# Altium project DD2090_4CAM_FFC_R0M0E0.PrjPcb (part 1 of 5)
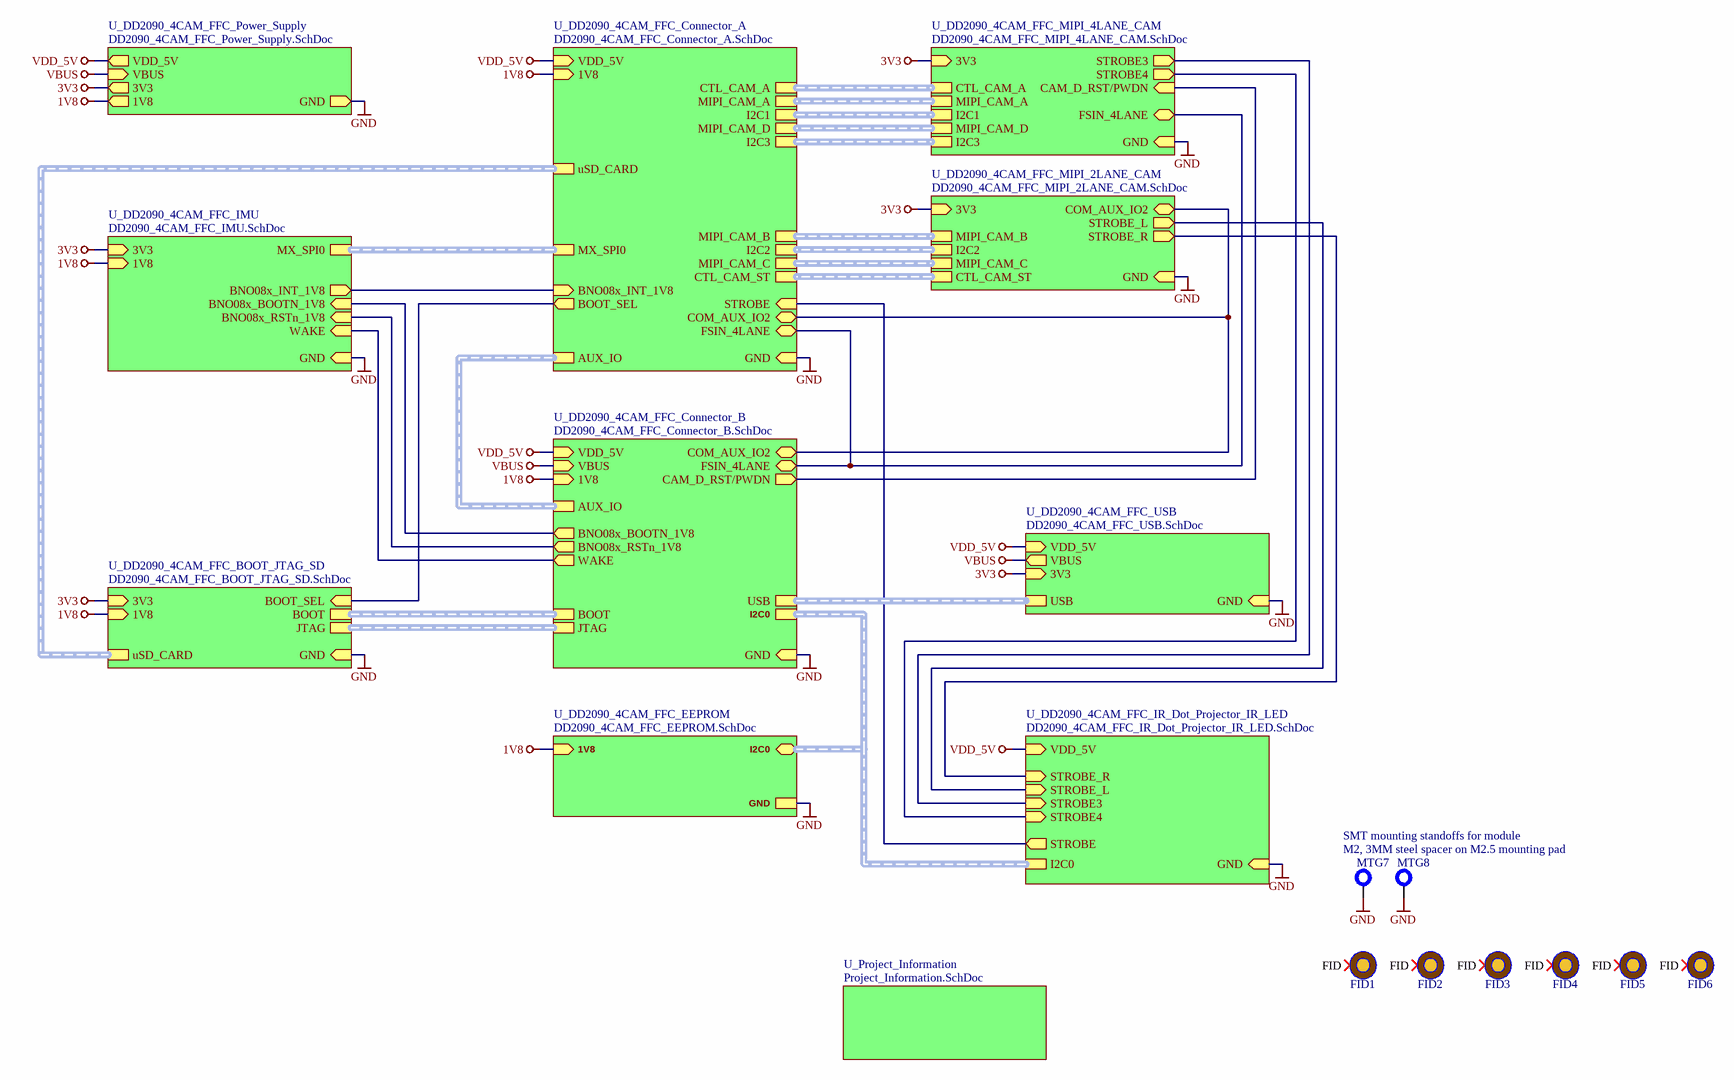
[diagram p0: DD2090_4CAM_FFC_TopLevel.SchDoc]
document_number: D0000190; drawn_by: Dan Dunga; project_title: DD2090 4CAM FFC; rev: R0M0E0
10 sheets, 166 parts. Net scope: strictly hierarchical (ports join the sheet entries above them; power ports are local).
Board file: DD2090_4CAM_FFC.PcbDoc
Sheets:
  DD2090_4CAM_FFC_TopLevel.SchDoc
    U_DD2090_4CAM_FFC_USB = DD2090_4CAM_FFC_USB.SchDoc
    U_Project_Information = Project_Information.SchDoc
    U_DD2090_4CAM_FFC_Power_Supply = DD2090_4CAM_FFC_Power_Supply.SchDoc
    U_DD2090_4CAM_FFC_IMU = DD2090_4CAM_FFC_IMU.SchDoc
    U_DD2090_4CAM_FFC_BOOT_JTAG_SD = DD2090_4CAM_FFC_BOOT_JTAG_SD.SchDoc
    U_DD2090_4CAM_FFC_MIPI_2LANE_CAM = DD2090_4CAM_FFC_MIPI_2LANE_CAM.SchDoc
    U_DD2090_4CAM_FFC_MIPI_4LANE_CAM = DD2090_4CAM_FFC_MIPI_4LANE_CAM.SchDoc
    U_DD2090_4CAM_FFC_Connector_A = DD2090_4CAM_FFC_Connector_A.SchDoc
    U_DD2090_4CAM_FFC_Connector_B = DD2090_4CAM_FFC_Connector_B.SchDoc

## Sheet DD2090_4CAM_FFC_TopLevel.SchDoc: =project_title
size Tabloid; PageSetup: Record=PageOptions|CenterHorizontal=True|CenterVertical=True|PrintScale=0.73|XCorrection=1.00|YCorrection=1.00|PrintKind=0|BorderSize=5000000|LeftOffset=0|BottomOffset=0|Orientation=2|PaperLength=1000|PaperWidth=1000|Scale=100|PaperSource=7|PrintQuality=-4|MediaType=1|DitherType=10|PaperKind=A4|PrintScaleMode=1; CompanyName: Luxonis Holding; DrawnBy: Dan Dunga; Organization: Luxonis Holding; Address1: 1925 Harmony Park Drive; Address2: Westminster, CO; Address3: 80234; Address4: United States; DocumentNumber: D0000190; SheetNumber: 1; SheetTotal: 12

### Parts
FID1  FIDUCIAL_ROUND_1MM  [FIDUCIAL_ROUND_1MM]  (value not drawn)  (no BOM)
FID2  FIDUCIAL_ROUND_1MM  [FIDUCIAL_ROUND_1MM]  (value not drawn)  (no BOM)
FID3  FIDUCIAL_ROUND_1MM  [FIDUCIAL_ROUND_1MM]  (value not drawn)  (no BOM)
FID4  FIDUCIAL_ROUND_1MM  [FIDUCIAL_ROUND_1MM]  (value not drawn)  (no BOM)
FID5  FIDUCIAL_ROUND_1MM  [FIDUCIAL_ROUND_1MM]  (value not drawn)  (no BOM)
FID6  FIDUCIAL_ROUND_1MM  [FIDUCIAL_ROUND_1MM]  (value not drawn)  (no BOM)
MTG7  M2, 3MM steel spacer on M2.5 mounting pad  [9774030243R]
MTG8  M2, 3MM steel spacer on M2.5 mounting pad  [9774030243R]  (value not drawn)

### Sub-sheets
U_DD2090_4CAM_FFC_BOOT_JTAG_SD = DD2090_4CAM_FFC_BOOT_JTAG_SD.SchDoc: 1V8 (in), GND (in), 3V3 (in), JTAG (harness JTAG), BOOT (harness BOOT), uSD_CARD (harness uSD_CARD), BOOT_SEL (in)
U_DD2090_4CAM_FFC_Connector_A = DD2090_4CAM_FFC_Connector_A.SchDoc: VDD_5V (in), GND (in), 1V8 (in), MIPI_CAM_A (harness MIPI_CAM_A), I2C1 (harness I2C1), MIPI_CAM_B (harness MIPI_CAM_B), I2C2 (harness I2C2), MIPI_CAM_C (harness MIPI_CAM_C), MX_SPI0 (harness MX_SPI0), BNO08x_INT_1V8 (in), CTL_CAM_A (harness CTL_CAM_A), MIPI_CAM_D (harness MIPI_CAM_D), uSD_CARD (harness uSD_CARD), COM_AUX_IO2 (bidir), I2C3 (harness I2C3), AUX_IO (harness AUX_IO), FSIN_4LANE (bidir), BOOT_SEL (out), CTL_CAM_ST (harness CTL_CAM_ST), STROBE (in)
U_DD2090_4CAM_FFC_Connector_B = DD2090_4CAM_FFC_Connector_B.SchDoc: VDD_5V (in), GND (in), VBUS (in), 1V8 (in), USB (harness USB), BNO08x_RSTn_1V8 (out), BNO08x_BOOTN_1V8 (out), BOOT (harness BOOT), JTAG (harness JTAG), CAM_D_RST/PWDN (out), FSIN_4LANE (bidir), COM_AUX_IO2 (bidir), AUX_IO (harness AUX_IO), I2C0 (harness I2C0), WAKE (out)
U_DD2090_4CAM_FFC_EEPROM = DD2090_4CAM_FFC_EEPROM.SchDoc (file not in this document): 1V8 (in), GND, I2C0 (bidir, harness I2C0)
U_DD2090_4CAM_FFC_IMU = DD2090_4CAM_FFC_IMU.SchDoc: BNO08x_BOOTN_1V8 (in), GND (in), 3V3 (in), BNO08x_INT_1V8 (out), BNO08x_RSTn_1V8 (in), 1V8 (in), MX_SPI0 (harness MX_SPI0), WAKE (in)
U_DD2090_4CAM_FFC_IR_Dot_Projector_IR_LED = DD2090_4CAM_FFC_IR_Dot_Projector_IR_LED.SchDoc (file not in this document): I2C0 (harness I2C0), GND (in), VDD_5V (in), STROBE_L (in), STROBE_R (in), STROBE3 (in), STROBE4 (in), STROBE (out)
U_DD2090_4CAM_FFC_MIPI_2LANE_CAM = DD2090_4CAM_FFC_MIPI_2LANE_CAM.SchDoc: MIPI_CAM_B (harness MIPI_CAM_B), I2C2 (harness I2C), MIPI_CAM_C (harness MIPI_CAM_C), GND (in), 3V3 (in), CTL_CAM_ST (harness CTL_CAM_ST), COM_AUX_IO2 (bidir), STROBE_L (out), STROBE_R (out)
U_DD2090_4CAM_FFC_MIPI_4LANE_CAM = DD2090_4CAM_FFC_MIPI_4LANE_CAM.SchDoc: I2C1 (harness I2C1), MIPI_CAM_A (harness MIPI_CAM_A), CTL_CAM_A (harness CTL_CAM_A), GND (in), 3V3 (in), MIPI_CAM_D (harness MIPI_CAM_D), I2C3 (harness I2C3), CAM_D_RST/PWDN (in), FSIN_4LANE (bidir), STROBE3 (out), STROBE4 (out)
U_DD2090_4CAM_FFC_Power_Supply = DD2090_4CAM_FFC_Power_Supply.SchDoc: GND (out), 1V8 (out), VDD_5V (out), 3V3 (out), VBUS (in)
U_DD2090_4CAM_FFC_USB = DD2090_4CAM_FFC_USB.SchDoc: VBUS (out), GND (in), 3V3 (in), VDD_5V (in), USB (harness USB)
U_Project_Information = Project_Information.SchDoc: no entries

### Nets
1V8: sheet U_DD2090_4CAM_FFC_Power_Supply/1V8, sheet U_DD2090_4CAM_FFC_IMU/1V8, sheet U_DD2090_4CAM_FFC_BOOT_JTAG_SD/1V8, sheet U_DD2090_4CAM_FFC_Connector_A/1V8, sheet U_DD2090_4CAM_FFC_Connector_B/1V8, sheet U_DD2090_4CAM_FFC_EEPROM/1V8
3V3: sheet U_DD2090_4CAM_FFC_USB/3V3, sheet U_DD2090_4CAM_FFC_Power_Supply/3V3, sheet U_DD2090_4CAM_FFC_IMU/3V3, sheet U_DD2090_4CAM_FFC_BOOT_JTAG_SD/3V3, sheet U_DD2090_4CAM_FFC_MIPI_2LANE_CAM/3V3, sheet U_DD2090_4CAM_FFC_MIPI_4LANE_CAM/3V3
GND: MTG7.1 MTG8.1 ; sheet U_DD2090_4CAM_FFC_USB/GND, sheet U_DD2090_4CAM_FFC_Power_Supply/GND, sheet U_DD2090_4CAM_FFC_IMU/GND, sheet U_DD2090_4CAM_FFC_BOOT_JTAG_SD/GND, sheet U_DD2090_4CAM_FFC_MIPI_2LANE_CAM/GND, sheet U_DD2090_4CAM_FFC_MIPI_4LANE_CAM/GND, sheet U_DD2090_4CAM_FFC_Connector_A/GND, sheet U_DD2090_4CAM_FFC_Connector_B/GND, sheet U_DD2090_4CAM_FFC_EEPROM/GND, sheet U_DD2090_4CAM_FFC_IR_Dot_Projector_IR_LED/GND
VBUS: sheet U_DD2090_4CAM_FFC_USB/VBUS, sheet U_DD2090_4CAM_FFC_Power_Supply/VBUS, sheet U_DD2090_4CAM_FFC_Connector_B/VBUS
VDD_5V: sheet U_DD2090_4CAM_FFC_USB/VDD_5V, sheet U_DD2090_4CAM_FFC_Power_Supply/VDD_5V, sheet U_DD2090_4CAM_FFC_Connector_A/VDD_5V, sheet U_DD2090_4CAM_FFC_Connector_B/VDD_5V, sheet U_DD2090_4CAM_FFC_IR_Dot_Projector_IR_LED/VDD_5V
BNO08x_BOOTN_1V8: sheet U_DD2090_4CAM_FFC_IMU/BNO08x_BOOTN_1V8, sheet U_DD2090_4CAM_FFC_Connector_B/BNO08x_BOOTN_1V8
BNO08x_INT_1V8: sheet U_DD2090_4CAM_FFC_IMU/BNO08x_INT_1V8, sheet U_DD2090_4CAM_FFC_Connector_A/BNO08x_INT_1V8
BNO08x_RSTn_1V8: sheet U_DD2090_4CAM_FFC_IMU/BNO08x_RSTn_1V8, sheet U_DD2090_4CAM_FFC_Connector_B/BNO08x_RSTn_1V8
BOOT_SEL: sheet U_DD2090_4CAM_FFC_BOOT_JTAG_SD/BOOT_SEL, sheet U_DD2090_4CAM_FFC_Connector_A/BOOT_SEL
CAM2_RST: sheet U_DD2090_4CAM_FFC_MIPI_4LANE_CAM/CAM_D_RST/PWDN, sheet U_DD2090_4CAM_FFC_Connector_B/CAM_D_RST/PWDN
COM_AUX_IO2: sheet U_DD2090_4CAM_FFC_MIPI_2LANE_CAM/COM_AUX_IO2, sheet U_DD2090_4CAM_FFC_Connector_A/COM_AUX_IO2, sheet U_DD2090_4CAM_FFC_Connector_B/COM_AUX_IO2
FSIN_4LANE: sheet U_DD2090_4CAM_FFC_MIPI_4LANE_CAM/FSIN_4LANE, sheet U_DD2090_4CAM_FFC_Connector_A/FSIN_4LANE, sheet U_DD2090_4CAM_FFC_Connector_B/FSIN_4LANE
STROBE: sheet U_DD2090_4CAM_FFC_Connector_A/STROBE, sheet U_DD2090_4CAM_FFC_IR_Dot_Projector_IR_LED/STROBE
STROBE1: sheet U_DD2090_4CAM_FFC_MIPI_2LANE_CAM/STROBE_L, sheet U_DD2090_4CAM_FFC_IR_Dot_Projector_IR_LED/STROBE_L
STROBE2: sheet U_DD2090_4CAM_FFC_MIPI_2LANE_CAM/STROBE_R, sheet U_DD2090_4CAM_FFC_IR_Dot_Projector_IR_LED/STROBE_R
STROBE3: sheet U_DD2090_4CAM_FFC_MIPI_4LANE_CAM/STROBE3, sheet U_DD2090_4CAM_FFC_IR_Dot_Projector_IR_LED/STROBE3
STROBE4: sheet U_DD2090_4CAM_FFC_MIPI_4LANE_CAM/STROBE4, sheet U_DD2090_4CAM_FFC_IR_Dot_Projector_IR_LED/STROBE4
WAKE: sheet U_DD2090_4CAM_FFC_IMU/WAKE, sheet U_DD2090_4CAM_FFC_Connector_B/WAKE

Not connected (* = marked no-connect by the designer): FID1 FID*; FID2 FID*; FID3 FID*; FID4 FID*; FID5 FID*; FID6 FID*

### Buses and harness runs
harness sheet U_DD2090_4CAM_FFC_BOOT_JTAG_SD/BOOT = sheet U_DD2090_4CAM_FFC_Connector_B/BOOT
harness sheet U_DD2090_4CAM_FFC_BOOT_JTAG_SD/JTAG = sheet U_DD2090_4CAM_FFC_Connector_B/JTAG
harness sheet U_DD2090_4CAM_FFC_BOOT_JTAG_SD/uSD_CARD = sheet U_DD2090_4CAM_FFC_Connector_A/uSD_CARD
harness sheet U_DD2090_4CAM_FFC_Connector_A/AUX_IO = sheet U_DD2090_4CAM_FFC_Connector_B/AUX_IO
harness sheet U_DD2090_4CAM_FFC_Connector_A/CTL_CAM_A = sheet U_DD2090_4CAM_FFC_MIPI_4LANE_CAM/CTL_CAM_A
harness sheet U_DD2090_4CAM_FFC_Connector_A/CTL_CAM_ST = sheet U_DD2090_4CAM_FFC_MIPI_2LANE_CAM/CTL_CAM_ST
harness sheet U_DD2090_4CAM_FFC_Connector_A/I2C1 = sheet U_DD2090_4CAM_FFC_MIPI_4LANE_CAM/I2C1
harness sheet U_DD2090_4CAM_FFC_Connector_A/I2C2 = sheet U_DD2090_4CAM_FFC_MIPI_2LANE_CAM/I2C2
harness sheet U_DD2090_4CAM_FFC_Connector_A/I2C3 = sheet U_DD2090_4CAM_FFC_MIPI_4LANE_CAM/I2C3
harness sheet U_DD2090_4CAM_FFC_Connector_A/MIPI_CAM_A = sheet U_DD2090_4CAM_FFC_MIPI_4LANE_CAM/MIPI_CAM_A
harness sheet U_DD2090_4CAM_FFC_Connector_A/MIPI_CAM_B = sheet U_DD2090_4CAM_FFC_MIPI_2LANE_CAM/MIPI_CAM_B
harness sheet U_DD2090_4CAM_FFC_Connector_A/MIPI_CAM_C = sheet U_DD2090_4CAM_FFC_MIPI_2LANE_CAM/MIPI_CAM_C
harness sheet U_DD2090_4CAM_FFC_Connector_A/MIPI_CAM_D = sheet U_DD2090_4CAM_FFC_MIPI_4LANE_CAM/MIPI_CAM_D
harness sheet U_DD2090_4CAM_FFC_Connector_A/MX_SPI0 = sheet U_DD2090_4CAM_FFC_IMU/MX_SPI0
harness sheet U_DD2090_4CAM_FFC_Connector_B/I2C0 = sheet U_DD2090_4CAM_FFC_EEPROM/I2C0 = sheet U_DD2090_4CAM_FFC_IR_Dot_Projector_IR_LED/I2C0
harness sheet U_DD2090_4CAM_FFC_Connector_B/USB = sheet U_DD2090_4CAM_FFC_USB/USB

### Notes on the sheet
- SMT mounting standoffs for module
- Title
- Size:
- Date:
- Tabloid
- Number:
- Time:
- Revision:
- Sheet
- of
- Drawn by:

### Library data of the parts
FID1-FID6 = FIDUCIAL: Fiducial with various available footprints
MTG7 MTG8 = 9774030243R: MP ROUND STANDOFF M2X0.4 STEEL 3MM; Manufacturer 1: Wurth Electronics; Plating: Tin; Threaded/Unthreaded: Threaded; Outside Diameter: 0.171inch; Supplier 1: Digi-Key; Manufacturer Part Number 1: 9774030243R; Stock 1: 20568; Pricing 1: 1=0.95000, 10=0.91800, 50=0.79500, 100=0.73900 (USD); RoHS: Yes; Material: Steel; Length: 0.173inch; REACH SVHC: Unknown; ComponentLink1URL: http://www.mouser.com/ds/2/445/9774030243R-611455.pdf?src-supplier=Mouser; ComponentLink1Description: http://www.mouser.com/ds/2/445/9774030243R-611455.pdf?src-supplier=Mouser; ComponentLink2URL: http://www.farnell.com/datasheets/1960368.pdf?src-supplier=Farnell; ComponentLink2Description: http://www.farnell.com/datasheets/1960368.pdf?src-supplier=Farnell; ComponentLink3URL: https://katalog.we-online.de/em/datasheet/9774030243R.pdf?src-supplier=Digi-Key; ComponentLink3Description: https://katalog.we-online.de/em/datasheet/9774030243R.pdf?src-supplier=Digi-Key; ComponentLink4URL: http://www.farnell.com/datasheets/1960368.pdf?src-supplier=Newark; ComponentLink4Description: http://www.farnell.com/datasheets/1960368.pdf?src-supplier=Newark; ComponentLink5URL: http://www.farnell.com/datasheets/1960368.pdf?src-supplier=Element14; ComponentLink5Description: http://www.farnell.com/datasheets/1960368.pdf?src-supplier=Element14; Supplier Part Number 1: 732-7085-1-ND; Supplier 2: Mouser; Supplier Part Number 2: 710-9774030243R; Supplier 3: Element14; Supplier Part Number 3: 2497599

## Sheet DD2090_4CAM_FFC_USB.SchDoc: =project_title
size Tabloid; PageSetup: Record=PageOptions|CenterHorizontal=True|CenterVertical=True|PrintScale=0.73|XCorrection=1.00|YCorrection=1.00|PrintKind=0|BorderSize=5000000|LeftOffset=0|BottomOffset=0|Orientation=2|PaperLength=1000|PaperWidth=1000|Scale=100|PaperSource=7|PrintQuality=-4|MediaType=1|DitherType=10|PaperKind=A4|PrintScaleMode=1; CompanyName: Luxonis Holding; DrawnBy: David Malovrh; Organization: Luxonis Holding; Address1: 1925 Harmony Park Drive; Address2: Westminster, CO; Address3: 80234; Address4: United States; DocumentNumber: D0000190; SheetNumber: 8; SheetTotal: 11
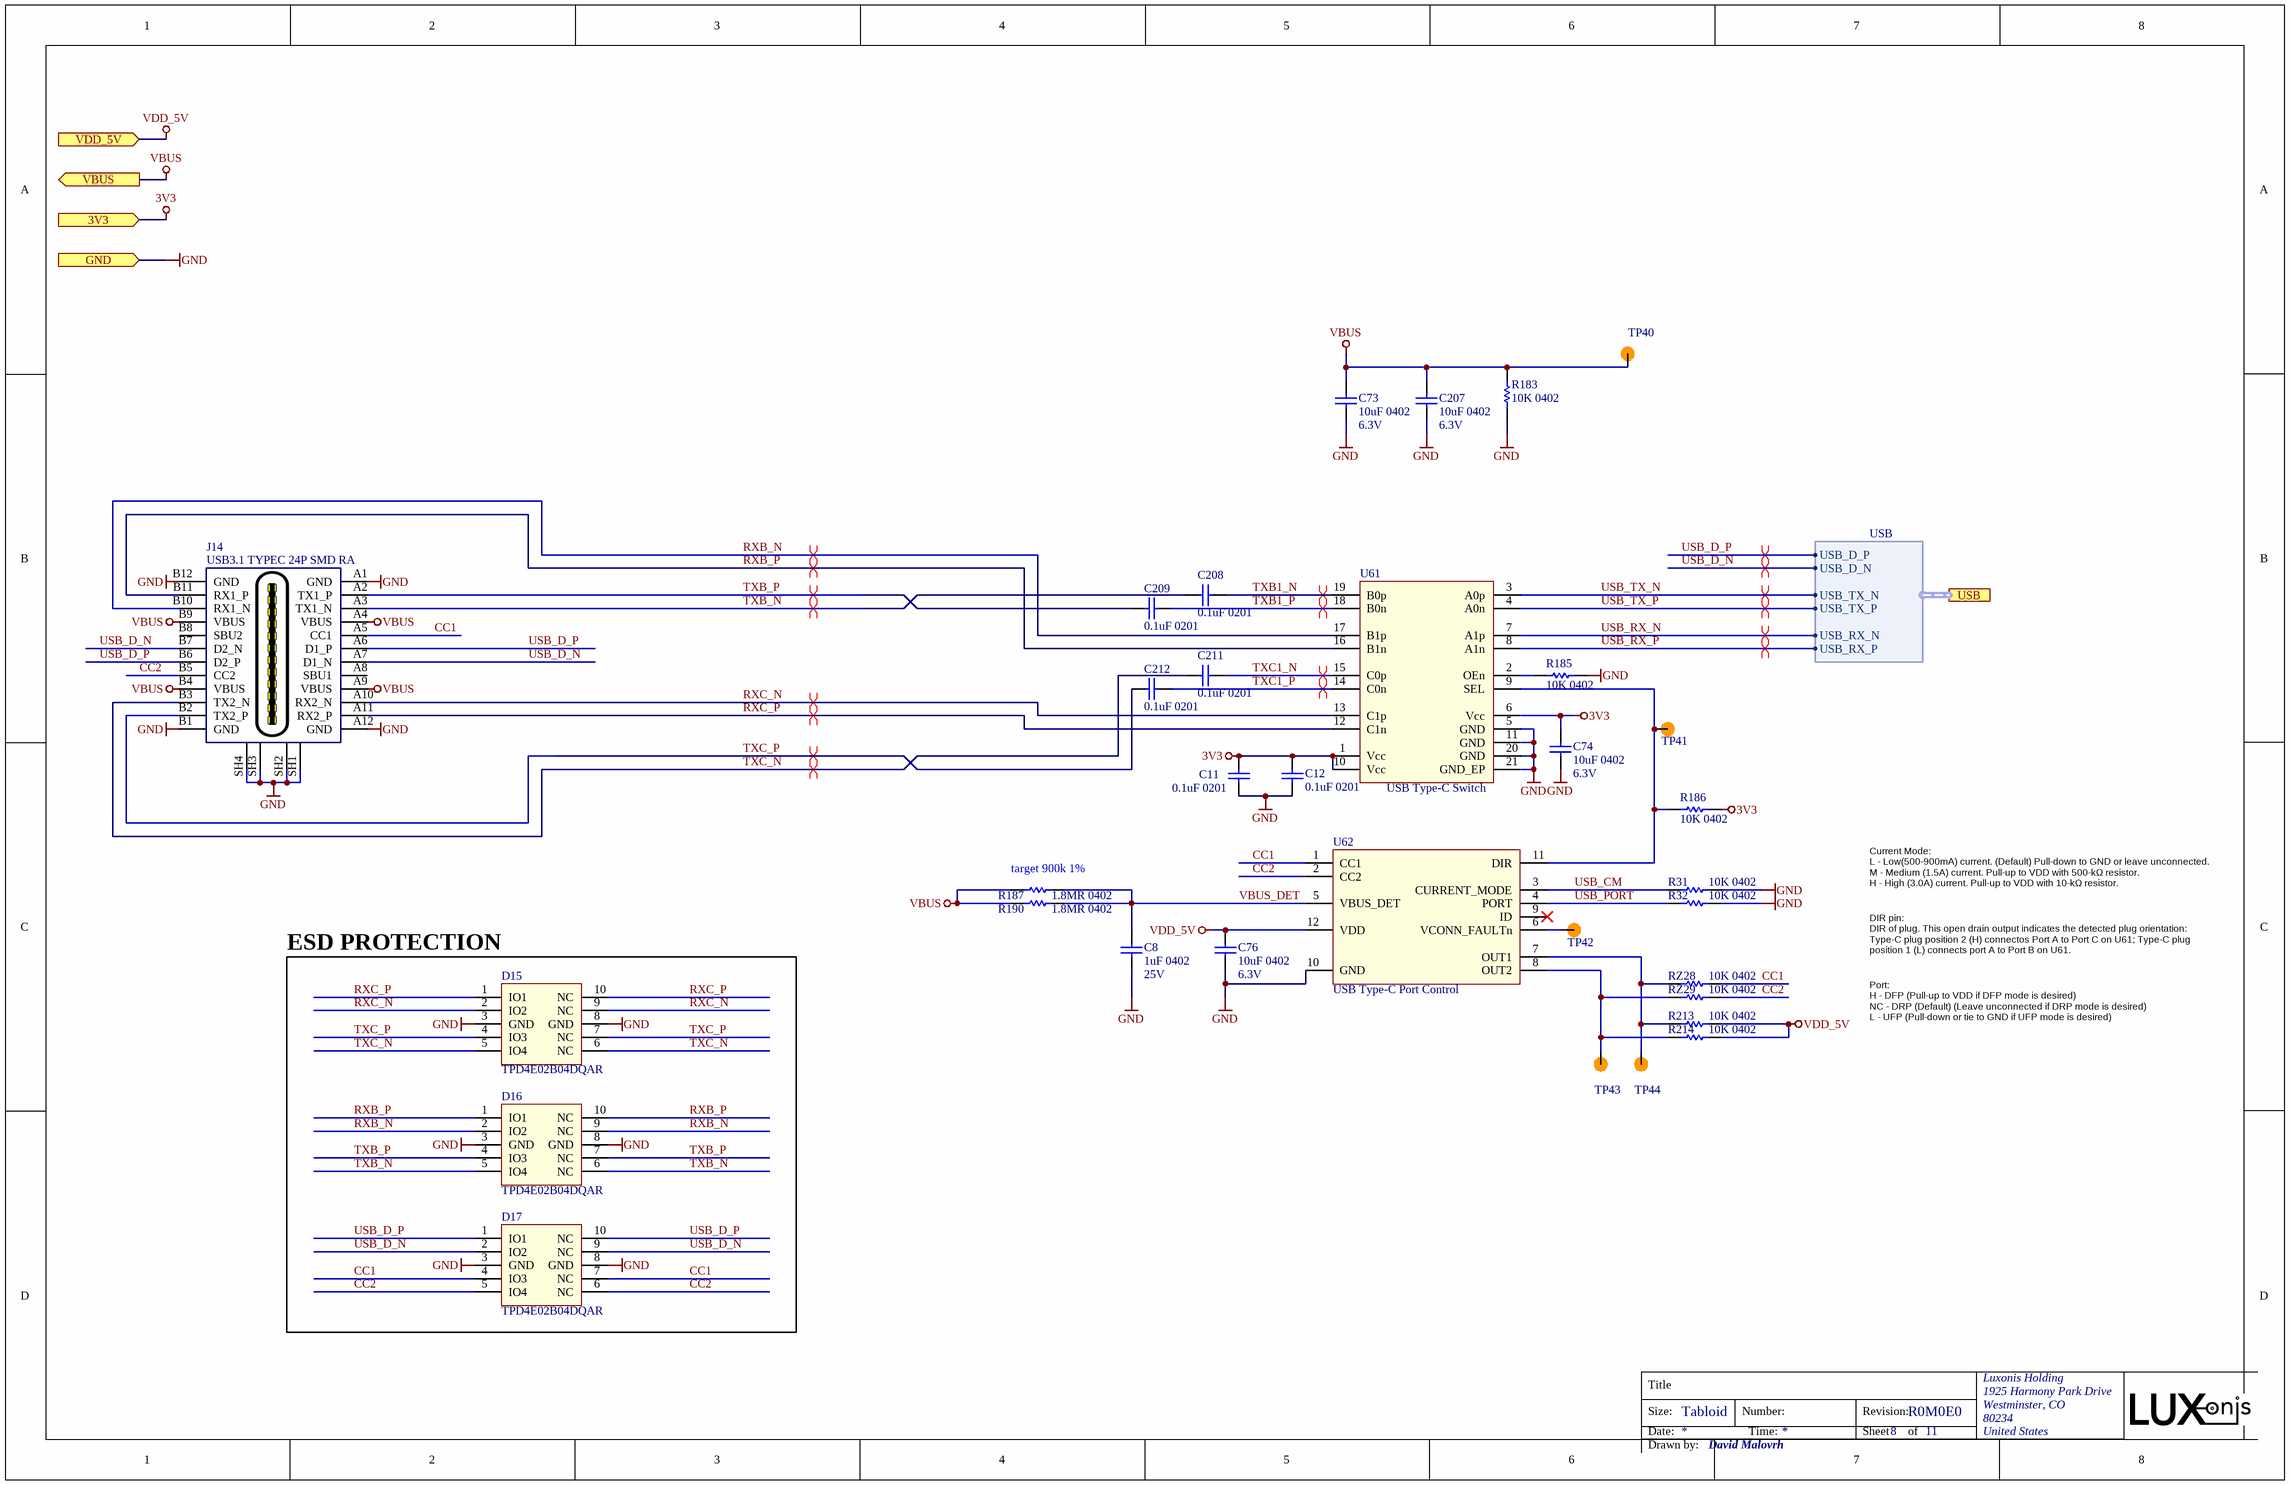
[diagram p1: DD2090_4CAM_FFC_USB.SchDoc]

### Parts
C8  1uF 0402  Voltage Rating: 25V  [CAPC0402(1005)70_N]
C11  0.1uF 0201  [CAPC0201(0603)33_L]
C12  0.1uF 0201  [CAPC0201(0603)33_L]
C73  10uF 0402  Voltage Rating: 6.3V  [CAPC0402(1005)70_N]
C74  10uF 0402  Voltage Rating: 6.3V  [CAPC0402(1005)70_N]
C76  10uF 0402  Voltage Rating: 6.3V  [CAPC0402(1005)70_N]
C207  10uF 0402  Voltage Rating: 6.3V  [CAPC0402(1005)70_N]
C208  0.1uF 0201  [CAPC0201(0603)33_L]
C209  0.1uF 0201  [CAPC0201(0603)33_L]
C211  0.1uF 0201  [CAPC0201(0603)33_L]
C212  0.1uF 0201  [CAPC0201(0603)33_L]
D15  TPD4E02B04DQAR  [TPD4E02B04DQAR]
D16  TPD4E02B04DQAR  [TPD4E02B04DQAR]
D17  TPD4E02B04DQAR  [TPD4E02B04DQAR]
J14  USB3.1 TYPEC 24P SMD RA  [105450-0101]
R31  10K 0402  [RESC0402(1005)_N]
R32  10K 0402  [RESC0402(1005)_N]
R183  10K 0402  [RESC0402(1005)_N]
R185  10K 0402  [RESC0402(1005)_N]
R186  10K 0402  [RESC0402(1005)_N]
R187  1.8MR 0402  [RESC0402(1005)_N]
R190  1.8MR 0402  [RESC0402(1005)_N]
R213  10K 0402  [RESC0402(1005)_N]
R214  10K 0402  [RESC0402(1005)_N]
RZ28  10K 0402  [RESC0402(1005)_N]
RZ29  10K 0402  [RESC0402(1005)_N]
TP40  TP100_200_NS  [TP100_200_NS]  (value not drawn)  (no BOM)
TP41  TP100_200_NS  [TP100_200_NS]  (value not drawn)  (no BOM)
TP42  TP100_200_NS  [TP100_200_NS]  (value not drawn)  (no BOM)
TP43  TP100_200_NS  [TP100_200_NS]  (value not drawn)  (no BOM)
TP44  TP100_200_NS  [TP100_200_NS]  (value not drawn)  (no BOM)
U61  USB Type-C Switch  [CBTL02043A]
U62  USB Type-C Port Control  [TUSB321RWBR]

### Blocks framed on the sheet
ESD PROTECTION: D15-D17

### Ports
3V3 (in), GND (in), USB (harness USB), VBUS (out), VDD_5V (in)

### Harnesses
USB: USB_D_P, USB_D_N, USB_TX_N, USB_TX_P, USB_RX_N, USB_RX_P

### Nets
3V3: C11.2 C12.2 C74.2 R186.2 U61.1(Vcc) U61.6(Vcc) U61.10(Vcc) ; port 3V3
GND: C8.1 C11.1 C12.1 C73.1 C74.1 C76.1 C207.1 D15.3(GND) D15.8(GND) D16.3(GND) D16.8(GND) D17.3(GND) D17.8(GND) J14.A1(GND) J14.A12(GND) J14.B1(GND) J14.B12(GND) J14.SH1(SH) J14.SH2(SH) J14.SH3(SH) J14.SH4(SH) R31.2 R32.2 R183.1 R185.2 U61.5(GND) U61.11(GND) U61.20(GND) U61.21(GND_EP) U62.10(GND) ; port GND
VBUS: C73.2 C207.2 J14.A4(VBUS) J14.A9(VBUS) J14.B4(VBUS) J14.B9(VBUS) R183.2 R187.1 R190.1 TP40.1 ; port VBUS
VDD_5V: C76.2 R213.2 R214.2 U62.12(VDD) ; port VDD_5V
CC1: D17.4(IO3) D17.7(NC) J14.A5(CC1) RZ28.2 U62.1(CC1)
CC2: D17.5(IO4) D17.6(NC) J14.B5(CC2) RZ29.2 U62.2(CC2)
RXB_N: D16.2(IO2) D16.9(NC) J14.B10(RX1_N) U61.17(B1p)
RXB_P: D16.1(IO1) D16.10(NC) J14.B11(RX1_P) U61.16(B1n)
RXC_N: D15.2(IO2) D15.9(NC) J14.A10(RX2_N) U61.13(C1p)
RXC_P: D15.1(IO1) D15.10(NC) J14.A11(RX2_P) U61.12(C1n)
TXB1_N: C208.2 U61.19(B0p)
TXB1_P: C209.2 U61.18(B0n)
TXB_N: C208.1 D16.5(IO4) D16.6(NC) J14.A3(TX1_N)
TXB_P: C209.1 D16.4(IO3) D16.7(NC) J14.A2(TX1_P)
TXC1_N: C211.2 U61.15(C0p)
TXC1_P: C212.2 U61.14(C0n)
TXC_N: C211.1 D15.5(IO4) D15.6(NC) J14.B3(TX2_N)
TXC_P: C212.1 D15.4(IO3) D15.7(NC) J14.B2(TX2_P)
USB_CM: R31.1 U62.3(CURRENT_MODE)
USB_D_N: D17.2(IO2) D17.9(NC) J14.A7(D1_N) J14.B7(D2_N) ; port USB.USB_D_N
USB_D_P: D17.1(IO1) D17.10(NC) J14.A6(D1_P) J14.B6(D2_P) ; port USB.USB_D_P
USB_PORT: R32.1 U62.4(PORT)
USB_RX_N: U61.7(A1p) ; port USB.USB_RX_N
USB_RX_P: U61.8(A1n) ; port USB.USB_RX_P
USB_TX_N: U61.3(A0p) ; port USB.USB_TX_N
USB_TX_P: U61.4(A0n) ; port USB.USB_TX_P
VBUS_DET: C8.2 R187.2 R190.2 U62.5(VBUS_DET)
NetR185_1: R185.1 U61.2(OEn)
NetR186_1: R186.1 TP41.1 U61.9(SEL) U62.11(DIR)
NetR213_1: R213.1 RZ28.1 TP44.1 U62.7(OUT1)
NetR214_1: R214.1 RZ29.1 TP43.1 U62.8(OUT2)
NetTP42_1: TP42.1 U62.6(VCONN_FAULTn)

Not connected (* = marked no-connect by the designer): J14 A8(SBU1) B8(SBU2); U62 9(ID)*

### Layout directives
differential pair; differential pair class USB3: RXB_N, RXB_P, RXC_N, RXC_P, TXB1_N, TXB1_P, TXB_N, TXB_P, TXC1_N, TXC1_P, TXC_N, TXC_P, USB_D_N, USB_D_P, USB_RX_N, USB_RX_P, USB_TX_N, USB_TX_P

### Notes on the sheet
- (near R187) target 900k 1%
- Current Mode:
  L - Low(500-900mA) current. (Default) Pull-down to GND or leave unconnected.
  M - Medium (1.5A) current. Pull-up to VDD with 500-kΩ resistor.
  H - High (3.0A) current. Pull-up to VDD with 10-kΩ resistor.
- DIR pin:
  DIR of plug. This open drain output indicates the detected plug orientation: Type-C plug position 2 (H) connectos Port A to Port C on U61; Type-C plug position 1 (L) connects port A to Port B on U61.
- Port:
  H - DFP (Pull-up to VDD if DFP mode is desired)
  NC - DRP (Default) (Leave unconnected if DRP mode is desired)
  L - UFP (Pull-down or tie to GND if UFP mode is desired)
- Title
- Size:
- Date:
- Tabloid
- Number:
- Time:
- Revision:
- Sheet
- of
- Drawn by:

### Library data of the parts
C8 = GRM155R61E105KA12D: CAP CER 1UF 25V X5R 0402 10%; Manufacturer 1: Murata; Material: Ceramic; Supplier 1: Digi-Key; Manufacturer Part Number 1: GRM155R61E105KA12D; Stock 1: 200653; Pricing 1: 1=0.10000, 10=0.07100, 100=0.03350, 500=0.02352, 1000=0.01947, 2500=0.01812, 5000=0.01658 (USD); RoHS: Yes; Mount: Surface Mount; Case/Package: 0402; Weight: 0.000212oz; Case Code (Metric): 1005; Case Code (Imperial): 0402; Min Operating Temperature: -55°C; Max Operating Temperature: 85°C; Tolerance: 10%; Capacitance: 1uF; Dielectric: X5R; Voltage Rating (DC): 25V; Packaging: Tape and Reel; Package Quantity: 10000; Termination: SMD/SMT; Voltage: 25V; Length: 1mm; Height: 0.5mm; Width: 0.5mm; Thickness: 0.022inch; Depth: 0.5mm; Lead Free: Lead Free; REACH SVHC: No SVHC; ComponentLink1URL: https://datasheet.ciiva.com/22732/1666664-22732122.pdf?src-supplier=Element14; ComponentLink1Description: https://datasheet.ciiva.com/22732/1666664-22732122.pdf?src-supplier=Element14; ComponentLink2URL: https://datasheet.ciiva.com/7719/1666664-7719006.pdf?src-supplier=Element14; ComponentLink2Description: https://datasheet.ciiva.com/7719/1666664-7719006.pdf?src-supplier=Element14; Supplier Part Number 1: 490-10017-1-ND; Supplier 2: Arrow; Supplier 3: TTI; Supplier Part Number 2: GRM155R61E105KA12D; Supplier Part Number 3: GRM155R61E105KA12D
C11 C12 C208 C209 C211 C212 = GRM033R61A104KE15D: CAP CER 0.1UF 10V X5R 0201; Manufacturer 1: Murata; Capacitance: 100nF; Tolerance: 10%; Supplier 1: Digi-Key; Manufacturer Part Number 1: GRM033R61A104KE15D; Stock 1: 45335312; Pricing 1: 1=0.10000, 10=0.04200, 100=0.01860, 500=0.01330, 1000=0.01045, 2500=0.00950, 5000=0.00874 (USD); RoHS: Yes; Mount: Surface Mount; Case/Package: 0201; Weight: 6E-06oz; Case Code (Metric): 0603; Case Code (Imperial): 0201; Min Operating Temperature: -55°C; Max Operating Temperature: 85°C; Packaging: Tape and Reel; Voltage Rating: 10V; Package Quantity: 1; Voltage Rating (DC): 10V; Dielectric: X5R; Termination: SMD/SMT; Length: 0.6mm; Height: 0.3mm; Width: 0.012inch; Thickness: 0.013inch; Depth: 0.3mm; Radiation Hardening: No; Lead Free: Lead Free; REACH SVHC: No SVHC; ComponentLink1URL: https://datasheet.ciiva.com/26843/getdatasheetpartid-308656-26843739.pdf?src-supplier=Verical; ComponentLink1Description: https://datasheet.ciiva.com/26843/getdatasheetpartid-308656-26843739.pdf?src-supplier=Verical; ComponentLink2URL: https://datasheet.ciiva.com/5413/product-5413117.pdf?src-supplier=Mouser; ComponentLink2Description: https://datasheet.ciiva.com/5413/product-5413117.pdf?src-supplier=Mouser; ComponentLink3URL: https://datasheet.ciiva.com/6256/partnumbering-e-01-6256406.pdf?src-supplier=Digi-Key; ComponentLink3Description: https://datasheet.ciiva.com/6256/partnumbering-e-01-6256406.pdf?src-supplier=Digi-Key; ComponentLink4URL: https://datasheet.ciiva.com/6256/partnumbering-e-01-6256407.pdf?src-supplier=Digi-Key; ComponentLink4Description: https://datasheet.ciiva.com/6256/partnumbering-e-01-6256407.pdf?src-supplier=Digi-Key; ComponentLink5URL: https://datasheet.ciiva.com/6256/partnumbering-e-01-6256408.pdf?src-supplier=Digi-Key; ComponentLink5Description: https://datasheet.ciiva.com/6256/partnumbering-e-01-6256408.pdf?src-supplier=Digi-Key; Supplier Part Number 1: 490-5881-1-ND; Voltage: 10V
C73 C74 C76 C207 = GRM155R60J106ME15D: CAP CER 10UF 6.3V X5R 0402 20%; Manufacturer 1: Murata; Supplier 1: Digi-Key; Manufacturer Part Number 1: GRM155R60J106ME15D; Stock 1: 1839627; Pricing 1: 1=0.23000, 10=0.15700, 100=0.07950, 500=0.05442, 1000=0.04814, 2500=0.04605, 5000=0.04186 (USD); RoHS: Yes; Mount: Surface Mount; Case/Package: 0402; Case Code (Metric): 1005; Case Code (Imperial): 0402; Min Operating Temperature: -55°C; Max Operating Temperature: 85°C; Packaging: Tape and Reel; Capacitance: 10uF; Dielectric: X5R; Length: 0.039inch; Width: 0.02inch; ComponentLink1URL: https://www.murata.com/~/media/webrenewal/support/library/catalog/products/capacitor/mlcc/c02e.ashx?la=en-us&src-supplier=Digi-Key; ComponentLink1Description: https://www.murata.com/~/media/webrenewal/support/library/catalog/products/capacitor/mlcc/c02e.ashx?la=en-us&src-supplier=Digi-Key; Supplier Part Number 1: 490-13238-1-ND; Voltage Rating (DC): 6.3V; Thickness: 0.026inch; Tolerance: 20%
D15-D17 = TPD4E02B04DQAR: TVS DIODE 3.6V 8.8V 10USON 8.8V (Typ) Clamp 5A (8/20µs) Ipp Tvs Diode Surface Mount 10-USON (2.5x1); Manufacturer 1: Texas Instruments; Number of Bidirectional Channels: 4; Min Breakdown Voltage: 5.5V; Peak Pulse Power: 17W; Power Line Protection: No; Interface: USB,HDMI; Supplier 1: Digi-Key; Manufacturer Part Number 1: TPD4E02B04DQAR; Stock 1: 25615; Pricing 1: 1=0.69000, 10=0.60800, 100=0.46650, 500=0.36874, 1000=0.29499 (USD); RoHS: Yes; Mount: Surface Mount; Number of Pins: 10; Min Operating Temperature: -40°C; Max Operating Temperature: 125°C; Packaging: Cut Tape; Reverse Standoff Voltage: 3.6V; Clamping Voltage: 8.8V; Operating Supply Voltage: 3.6V; Peak Pulse Current: 5A; Number of Channels: 4; Composition: Zener; REACH SVHC: No SVHC; Lead Free: Lead Free; ComponentLink1URL: http://www.ti.com/general/docs/lit/getliterature.tsp?genericPartNumber=TPD4E02B04&amp;&amp;fileType=pdf&src-supplier=Element14; ComponentLink1Description: http://www.ti.com/general/docs/lit/getliterature.tsp?genericPartNumber=TPD4E02B04&amp;&amp;fileType=pdf&src-supplier=Element14; ComponentLink2URL: http://www.ti.com/lit/ds/symlink/tpd4e02b04.pdf?src-supplier=Farnell; ComponentLink2Description: http://www.ti.com/lit/ds/symlink/tpd4e02b04.pdf?src-supplier=Farnell; ComponentLink3URL: http://www.ti.com/lit/ds/symlink/tpd4e02b04.pdf?src-supplier=Newark; ComponentLink3Description: http://www.ti.com/lit/ds/symlink/tpd4e02b04.pdf?src-supplier=Newark; ComponentLink4URL: http://www.ti.com/lit/ds/symlink/tpd4e02b04.pdf?src-supplier=Digi-Key; ComponentLink4Description: http://www.ti.com/lit/ds/symlink/tpd4e02b04.pdf?src-supplier=Digi-Key; Supplier Part Number 1: 296-43875-1-ND
J14 = 105450-0101: CONN RCP USB3.1 TYPEC 24P SMD RA; Manufacturer 1: Molex; Connector Type: USB; Number of Contacts: 24; Gender: Receptacle; Number of Ports: 1; Current Rating: 5A; Mating Cycles: 10000; Shielding: Shielded; Pitch: 0.5mm; Supplier 1: Digi-Key; Manufacturer Part Number 1: 105450-0101; Stock 1: 13882; Pricing 1: 1=2.15000, 10=1.94900, 25=1.82960, 50=1.75000, 100=1.67050, 250=1.51140, 500=1.39208 (USD); RoHS: Yes; Mount: Surface Mount,Through Hole,Horizontal; Case/Package: 0101; Number of Pins: 24; Contact Material: Copper Alloy; Contact Plating: Gold; Number of Terminals: 24; Housing Material: Thermoplastic; Insulation Color: Black; Min Operating Temperature: -30°C; Max Operating Temperature: 85°C; Packaging: Tape and Reel; Orientation: Right Angle; Termination: Solder; USB Standard: USB 3.1; Features: Shielded; Length: 8.94mm; REACH SVHC: Unknown; Flammability Rating: UL94 V-0; ComponentLink1URL: http://www.farnell.com/datasheets/2673427.pdf?src-supplier=Farnell; ComponentLink1Description: http://www.farnell.com/datasheets/2673427.pdf?src-supplier=Farnell; ComponentLink2URL: http://www.farnell.com/datasheets/2801634.pdf?src-supplier=Farnell; ComponentLink2Description: http://www.farnell.com/datasheets/2801634.pdf?src-supplier=Farnell; ComponentLink3URL: http://www.farnell.com/datasheets/2672741.pdf?src-supplier=Newark; ComponentLink3Description: http://www.farnell.com/datasheets/2672741.pdf?src-supplier=Newark; ComponentLink4URL: https://www.molex.com/pdm_docs/sd/1054500101_sd.pdf?src-supplier=Digi-Key; ComponentLink4Description: https://www.molex.com/pdm_docs/sd/1054500101_sd.pdf?src-supplier=Digi-Key; ComponentLink5URL: https://www.molex.com/pdm_docs/ps/PS-105448-001.pdf?src-supplier=Digi-Key; ComponentLink5Description: https://www.molex.com/pdm_docs/ps/PS-105448-001.pdf?src-supplier=Digi-Key; ComponentLink6URL: http://www.farnell.com/datasheets/2015275.pdf?src-supplier=Element14; ComponentLink6Description: http://www.farnell.com/datasheets/2015275.pdf?src-supplier=Element14; ComponentLink7URL: http://www.literature.molex.com/SQLImages/kelmscott/Molex/PDF_Images/987651-4081.PDF?src-supplier=Avnet; ComponentLink7Description: http://www.literature.molex.com/SQLImages/kelmscott/Molex/PDF_Images/987651-4081.PDF?src-supplier=Avnet; ComponentLink8URL: http://www.literature.molex.com/SQLImages/kelmscott/Molex/PDF_Images/987651-4081.PDF?src-supplier=Avnet+Asia; ComponentLink8Description: http://www.literature.molex.com/SQLImages/kelmscott/Molex/PDF_Images/987651-4081.PDF?src-supplier=Avnet+Asia; Supplier Part Number 1: WM12856CT-ND
R31 R32 R183 R185 R186 R213 R214 RZ28 RZ29 = RC0402FR-1310KL: RES SMD 10K OHM 1% 0402 1/16W Chip Resistor, 0402 [1005 Metric], 10 kohm, RC Series, 50 V, Thick Film, 62.5 mW; Manufacturer 1: Yageo; Resistance: 10kR; Temperature Coefficient: 100ppm/°C; Power Rating: 62.5mW; Voltage Rating: 50V; ComponentLink1URL: https://datasheet.ciiva.com/16940/pyu-rc0402-51-rohs-l-6-16940293.pdf?src-supplier=Avnet+Europe; ComponentLink1Description: https://datasheet.ciiva.com/16940/pyu-rc0402-51-rohs-l-6-16940293.pdf?src-supplier=Avnet+Europe; ComponentLink2URL: https://datasheet.ciiva.com/28386/pyu-rc0402-51-rohs-l-6-28386855.pdf?src-supplier=Avnet+Europe; ComponentLink2Description: https://datasheet.ciiva.com/28386/pyu-rc0402-51-rohs-l-6-28386855.pdf?src-supplier=Avnet+Europe; ComponentLink3URL: https://datasheet.ciiva.com/16740/pyu-rc0402-51-rohs-l-6-r-16740602.pdf?src-supplier=Future+Electronics; ComponentLink3Description: https://datasheet.ciiva.com/16740/pyu-rc0402-51-rohs-l-6-r-16740602.pdf?src-supplier=Future+Electronics; ComponentLink4URL: https://datasheet.ciiva.com/8891/pyu-rc0402-51-rohs-l-6-8891339.pdf?src-supplier=Avnet; ComponentLink4Description: https://datasheet.ciiva.com/8891/pyu-rc0402-51-rohs-l-6-8891339.pdf?src-supplier=Avnet; ComponentLink5URL: https://datasheet.ciiva.com/5557/pyu-rc0402-51-rohs-l-6-r-5557997.pdf?src-supplier=Mouser; ComponentLink5Description: https://datasheet.ciiva.com/5557/pyu-rc0402-51-rohs-l-6-r-5557997.pdf?src-supplier=Mouser; ComponentLink6URL: https://datasheet.ciiva.com/7983/1018594-7983533.pdf?src-supplier=Element14; ComponentLink6Description: https://datasheet.ciiva.com/7983/1018594-7983533.pdf?src-supplier=Element14; Supplier 1: Newark; Manufacturer Part Number 1: RC0402FR-1310KL; Stock 1: 62239; Pricing 1: 1=0.10000, 25=0.01200, 100=0.00400, 250=0.00400, 500=0.00300, 1000=0.00300 (USD); RoHS: Yes; Case/Package: 0402; Number of Pins: 2; Contact Plating: Tin,Matte,Lead; Case Code (Imperial): 0402; Case Code (Metric): 1005; Min Operating Temperature: -55°C; Max Operating Temperature: 155°C; Tolerance: 1%; Composition: Thick Film; Packaging: Tape and Reel; Termination: SMD/SMT; Military Standard: Not; Voltage Rating (DC): 50V; Working Voltage: 50V; Number of Terminations: 2; Length: 1mm; Depth: 0.5mm; Radiation Hardening: No; REACH SVHC: No SVHC; Lead Free: Lead Free; Supplier Part Number 1: 67R9960
R187 R190 = CRCW04021M80FKED: RES SMD 1.8M OHM 1% 1/16W 0402; Manufacturer 1: Vishay; Voltage Rating: 50V; Temperature Coefficient: 100ppm/°C; Power Rating: 63mW; Supplier 1: Digi-Key; Manufacturer Part Number 1: CRCW04021M80FKED; Stock 1: 26061; Pricing 1: 1=0.10000, 10=0.03800, 100=0.01540, 1000=0.00690, 2500=0.00599, 5000=0.00495 (USD); RoHS: Yes; Mount: Surface Mount; Case/Package: 0402; Number of Pins: 2; Weight: 2.3E-05oz; Case Code (Imperial): 0402; Case Code (Metric): 1005; Contact Plating: Tin; Min Operating Temperature: -55°C; Max Operating Temperature: 155°C; Packaging: Tape and Reel; Package Quantity: 10000; Termination: SMD/SMT; Voltage Rating (DC): 50V; Composition: Thick Film; Tolerance: 1%; Military Standard: Not; Resistance: 1.8MR; Length: 1mm; Height: 0.35mm; Width: 0.5mm; Depth: 0.5mm; Radiation Hardening: No; Lead Free: Lead Free; REACH SVHC: Unknown; ComponentLink1URL: https://datasheet.ciiva.com/11812/0900766b80d98824-11812579.pdf?src-supplier=RSComponents; ComponentLink1Description: https://datasheet.ciiva.com/11812/0900766b80d98824-11812579.pdf?src-supplier=RSComponents; ComponentLink2URL: https://datasheet.ciiva.com/16886/dcrcwe3-16886536.pdf?src-supplier=Avnet+Europe; ComponentLink2Description: https://datasheet.ciiva.com/16886/dcrcwe3-16886536.pdf?src-supplier=Avnet+Europe; ComponentLink3URL: https://datasheet.ciiva.com/7800/1697337-7800987.pdf?src-supplier=Element14; ComponentLink3Description: https://datasheet.ciiva.com/7800/1697337-7800987.pdf?src-supplier=Element14; ComponentLink4URL: https://datasheet.ciiva.com/16786/70201119-16786875.pdf?src-supplier=Allied+Electronics; ComponentLink4Description: https://datasheet.ciiva.com/16786/70201119-16786875.pdf?src-supplier=Allied+Electronics; ComponentLink5URL: https://datasheet.ciiva.com/22676/1700796-22676027.pdf?src-supplier=Element14; ComponentLink5Description: https://datasheet.ciiva.com/22676/1700796-22676027.pdf?src-supplier=Element14; ComponentLink6URL: https://datasheet.ciiva.com/7800/1697337-7800988.pdf?src-supplier=Element14; ComponentLink6Description: https://datasheet.ciiva.com/7800/1697337-7800988.pdf?src-supplier=Element14; ComponentLink7URL: https://datasheet.ciiva.com/26316/fld-crcw-e3-data-en-26316605.pdf?src-supplier=Distrelec; ComponentLink7Description: https://datasheet.ciiva.com/26316/fld-crcw-e3-data-en-26316605.pdf?src-supplier=Distrelec; ComponentLink8URL: https://datasheet.ciiva.com/8336/dcrcwe3-8336646.pdf?src-supplier=Avnet; ComponentLink8Description: https://datasheet.ciiva.com/8336/dcrcwe3-8336646.pdf?src-supplier=Avnet; Supplier Part Number 1: 541-1.80MLCT-ND
TP40-TP44 = TEST_POINT
U61 = CBTL02043A: Multiplexer And Demux/Decoder, CBT/FST/QS/5C/B Series, 1-Func, 2 Line Input, 1 Line Output, True Output, PQCC20; Manufacturer 1: NXP Semiconductors; Manufacturer Part Number 1: CBTL02043ABQ,115; Supplier 1: Digi-Key; RoHS: Yes; Category: Interface ICs; Stock 1: 19938; Pricing 1: 1=1,77000, 10=1,63000 (USD); ComponentLink1URL: https://datasheet.ciiva.com:443/pdfs/VipMasterIC/IC/PHGL/PHGL-S-A0000727649/PHGL-S-A0000727649-1.pdf?src-supplier=IHS+Markit; ComponentLink1Description: https://datasheet.ciiva.com:443/pdfs/VipMasterIC/IC/PHGL/PHGL-S-A0000727649/PHGL-S-A0000727649-1.pdf?src-supplier=IHS+Markit; ComponentLink2URL: https://datasheet.ciiva.com/4921/cbtl02043a-cbtl02043b-87520-4921245.pdf?src-supplier=Mouser; ComponentLink2Description: https://datasheet.ciiva.com/4921/cbtl02043a-cbtl02043b-87520-4921245.pdf?src-supplier=Mouser; ComponentLink3URL: https://datasheet.ciiva.com/6637/cbtl02043a-cbtl02043b-6637066.pdf?src-supplier=Digi-Key; ComponentLink3Description: https://datasheet.ciiva.com/6637/cbtl02043a-cbtl02043b-6637066.pdf?src-supplier=Digi-Key; Supplier Part Number 1: 568-6678-1-ND
U62 = TUSB321RWBR: IC USB PORT CONTROL TYPE-C 12X2Q; Manufacturer 1: Texas Instruments; Min Supply Voltage: 4.5V; Max Supply Voltage: 5.5V; Number of Ports: 1; USB Standard: USB 3.1; Supplier 1: Digi-Key; Manufacturer Part Number 1: TUSB321RWBR; Stock 1: 7746; Pricing 1: 1=2.27000, 10=2.04200, 100=1.64100, 500=1.34828, 1000=1.11714 (USD); RoHS: Yes; Mount: Surface Mount; Number of Pins: 12; Contact Plating: Gold; Min Operating Temperature: 0°C; Max Operating Temperature: 70°C; Packaging: Tape and Reel; REACH SVHC: No SVHC; Lead Free: Lead Free; ComponentLink1URL: http://www.ti.com/general/docs/lit/getliterature.tsp?genericPartNumber=TUSB321&&fileType=pdf&src-supplier=Avnet+Asia; ComponentLink1Description: http://www.ti.com/general/docs/lit/getliterature.tsp?genericPartNumber=TUSB321&&fileType=pdf&src-supplier=Avnet+Asia; ComponentLink2URL: http://www.ti.com/general/docs/lit/getliterature.tsp?genericPartNumber=TUSB321&&fileType=pdf&src-supplier=Farnell; ComponentLink2Description: http://www.ti.com/general/docs/lit/getliterature.tsp?genericPartNumber=TUSB321&&fileType=pdf&src-supplier=Farnell; ComponentLink3URL: http://www.ti.com/lit/ds/symlink/tusb321.pdf?src-supplier=Digi-Key; ComponentLink3Description: http://www.ti.com/lit/ds/symlink/tusb321.pdf?src-supplier=Digi-Key; ComponentLink4URL: http://www.ti.com/general/docs/lit/getliterature.tsp?genericPartNumber=TUSB321&&fileType=pdf&src-supplier=Element14; ComponentLink4Description: http://www.ti.com/general/docs/lit/getliterature.tsp?genericPartNumber=TUSB321&&fileType=pdf&src-supplier=Element14; ComponentLink5URL: http://www.ti.com/general/docs/lit/getliterature.tsp?genericPartNumber=TUSB321&&fileType=pdf&src-supplier=Avnet; ComponentLink5Description: http://www.ti.com/general/docs/lit/getliterature.tsp?genericPartNumber=TUSB321&&fileType=pdf&src-supplier=Avnet; Supplier Part Number 1: 296-42400-1-ND

## Sheet Project_Information.SchDoc: =project_title
size Tabloid; CompanyName: Luxonis Holding; DrawnBy: Dan Dunga; Organization: Luxonis Holding; Address1: 1925 Harmony Park Drive; Address2: Westminster, CO; Address3: 80234; Address4: United States; DocumentNumber: D0000190; SheetNumber: 2; SheetTotal: 12
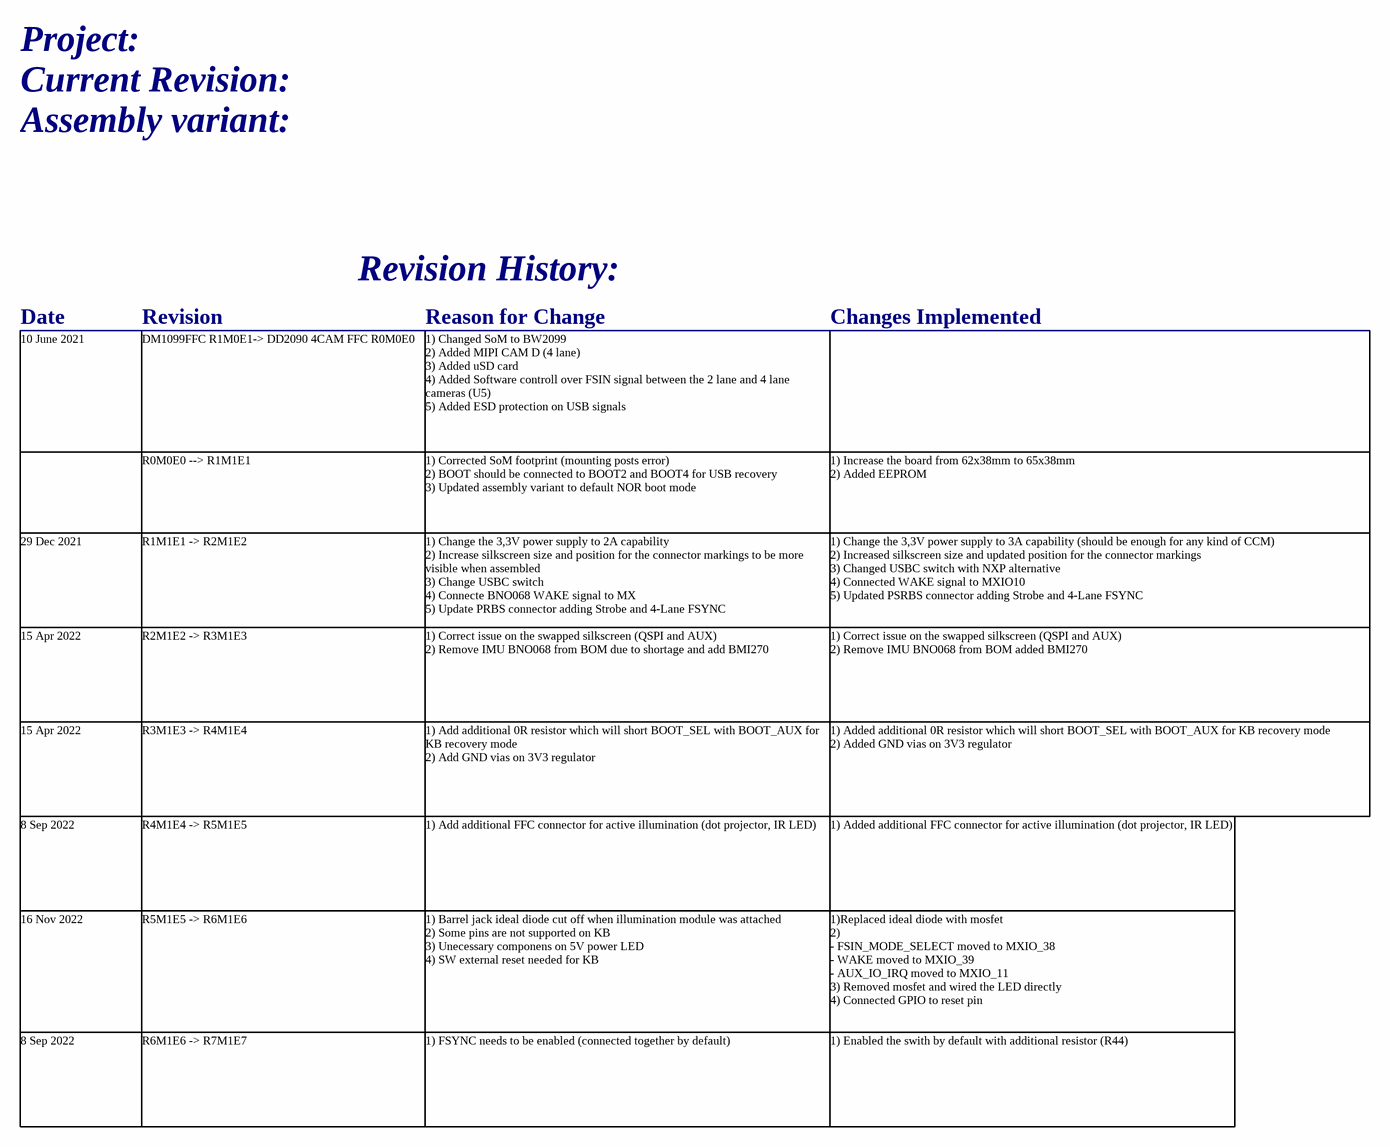
[diagram p2: Project_Information.SchDoc]

### Notes on the sheet
- Project:
- Current Revision:
- Assembly variant:
- Revision History:
- Date
- Revision
- Reason for Change
- Changes Implemented
- 10 June 2021
- DM1099FFC R1M0E1-> DD2090 4CAM FFC R0M0E0
- 1) Changed SoM to BW2099
  2) Added MIPI CAM D (4 lane)
  3) Added uSD card
  4) Added Software controll over FSIN signal between the 2 lane and 4 lane cameras (U5)
  5) Added ESD protection on USB signals
- R0M0E0 --> R1M1E1
- 1) Corrected SoM footprint (mounting posts error)
  2) BOOT should be connected to BOOT2 and BOOT4 for USB recovery
  3) Updated assembly variant to default NOR boot mode
- 1) Increase the board from 62x38mm to 65x38mm
  2) Added EEPROM
- 29 Dec 2021
- R1M1E1 -> R2M1E2
- 1) Change the 3,3V power supply to 2A capability
  2) Increase silkscreen size and position for the connector markings to be more visible when assembled
  3) Change USBC switch
  4) Connecte BNO068 WAKE signal to MX
  5) Update PRBS connector adding Strobe and 4-Lane FSYNC
- 1) Change the 3,3V power supply to 3A capability (should be enough for any kind of CCM)
  2) Increased silkscreen size and updated position for the connector markings
  3) Changed USBC switch with NXP alternative
  4) Connected WAKE signal to MXIO10
  5) Updated PSRBS connector adding Strobe and 4-Lane FSYNC
- 15 Apr 2022
- R2M1E2 -> R3M1E3
- 1) Correct issue on the swapped silkscreen (QSPI and AUX)
  2) Remove IMU BNO068 from BOM due to shortage and add BMI270
- 1) Correct issue on the swapped silkscreen (QSPI and AUX)
  2) Remove IMU BNO068 from BOM added BMI270
- R3M1E3 -> R4M1E4
- 1) Add additional 0R resistor which will short BOOT_SEL with BOOT_AUX for KB recovery mode
  2) Add GND vias on 3V3 regulator
- 1) Added additional 0R resistor which will short BOOT_SEL with BOOT_AUX for KB recovery mode
  2) Added GND vias on 3V3 regulator
- 8 Sep 2022
- R4M1E4 -> R5M1E5
- 1) Add additional FFC connector for active illumination (dot projector, IR LED)
- 1) Added additional FFC connector for active illumination (dot projector, IR LED)
- 16 Nov 2022
- R5M1E5 -> R6M1E6
- 1) Barrel jack ideal diode cut off when illumination module was attached
  2) Some pins are not supported on KB
  3) Unecessary componens on 5V power LED
  4) SW external reset needed for KB
- 1)Replaced ideal diode with mosfet
  2)
  - FSIN_MODE_SELECT moved to MXIO_38
  - WAKE moved to MXIO_39
  - AUX_IO_IRQ moved to MXIO_11
  3) Removed mosfet and wired the LED directly
  4) Connected GPIO to reset pin
- R6M1E6 -> R7M1E7
- 1) FSYNC needs to be enabled (connected together by default)
- 1) Enabled the swith by default with additional resistor (R44)
- Title
- Size:
- Date:
- Tabloid
- Number:
- Time:
- Revision:
- Sheet
- of
- Drawn by: